# EAGLE design matrix+segmen_shalat_v1.3A (EAGLE 9.5.2)

## Sheet 1 of 2
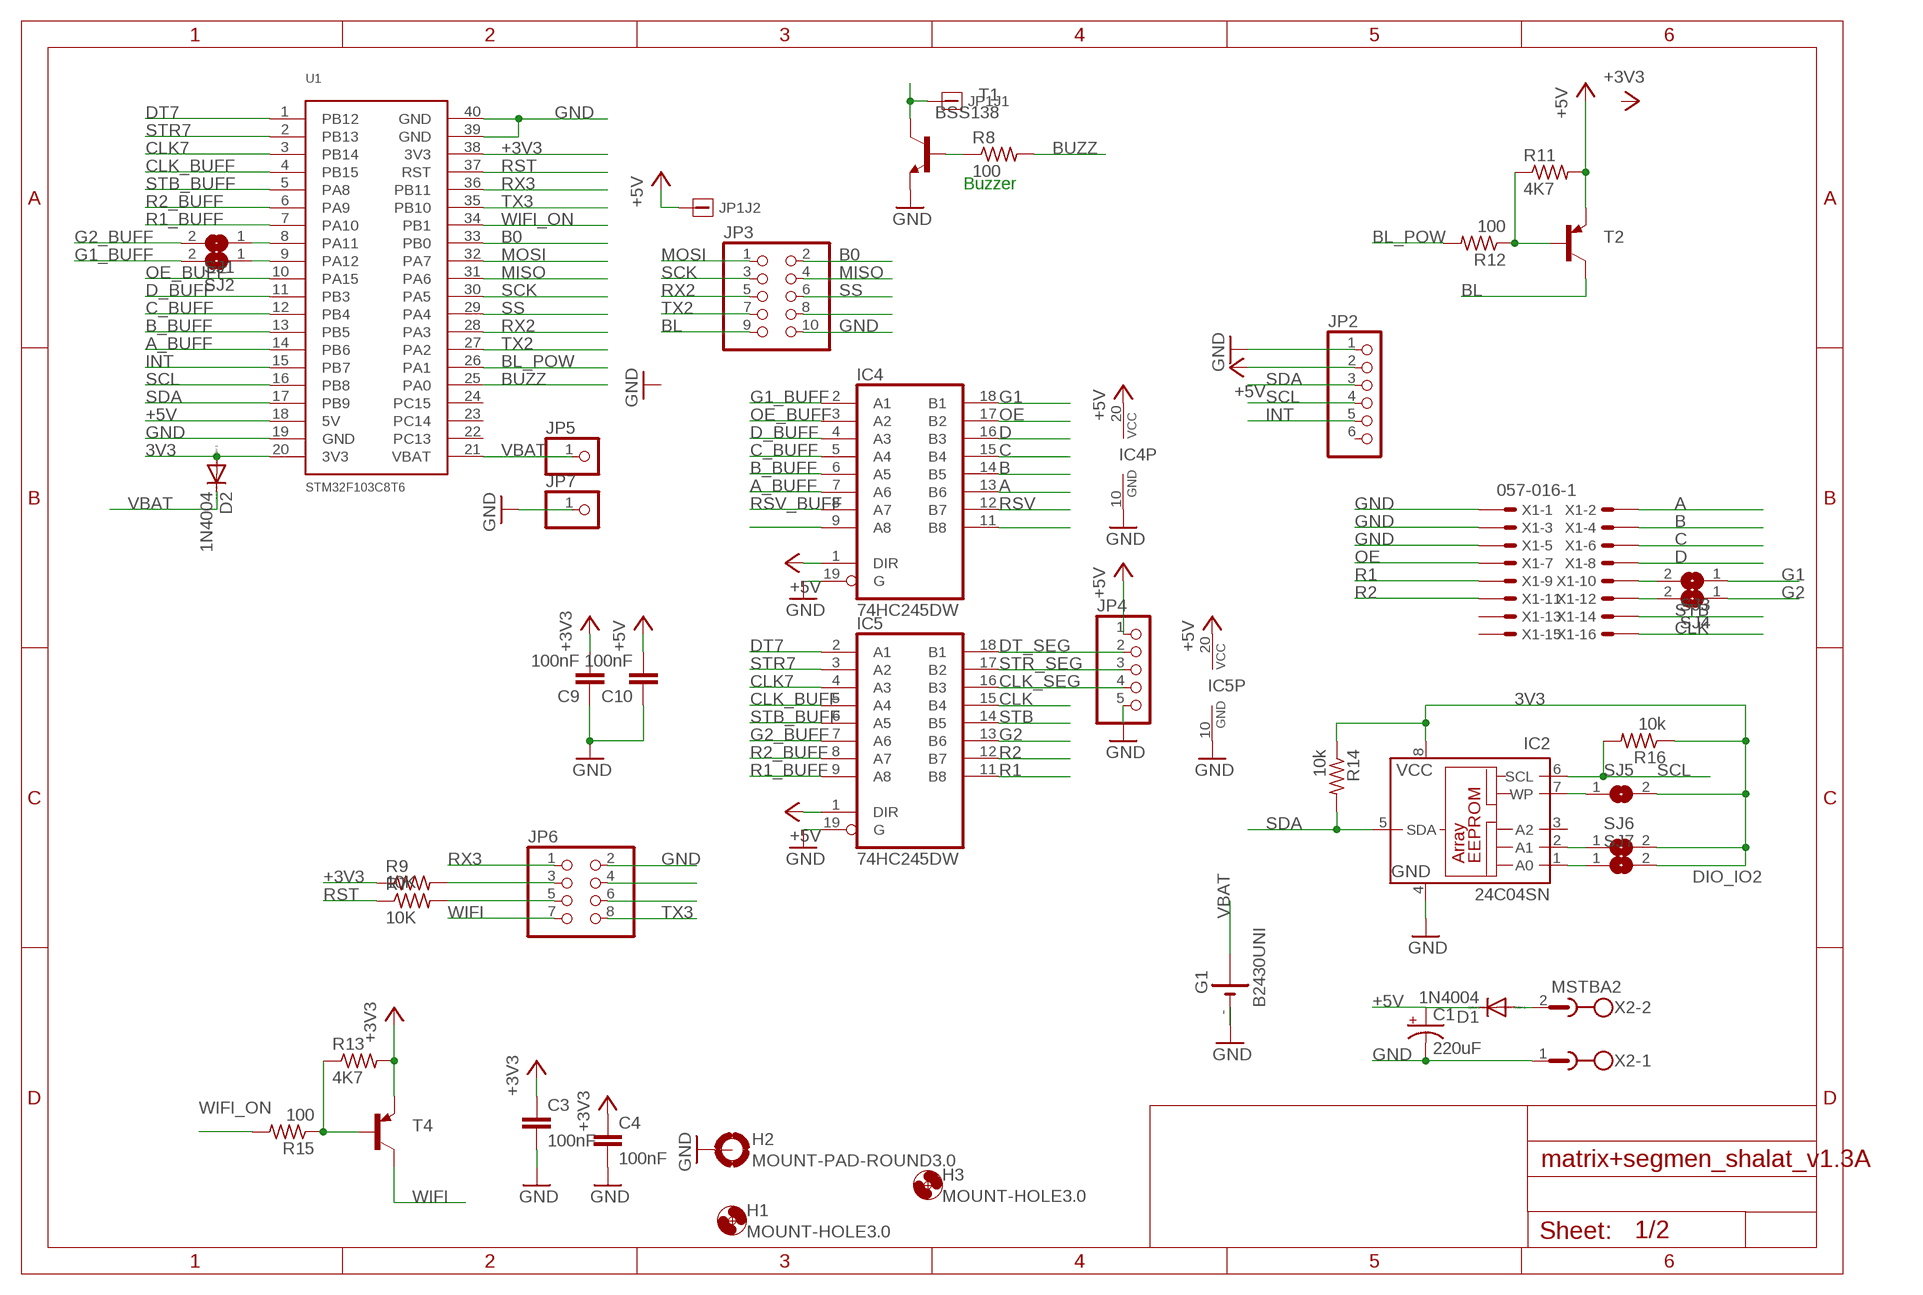
[diagram p0: schematic, sheet 1]

### Parts
C1  220uF  CPOL-USE3.5-8  [E3,5-8]
C3  100nF  C-EUC0805  [C0805]
C4  100nF  C-EUC0805  [C0805]
C9  100nF  C-EUC0805  [C0805]
C10  100nF  C-EUC0805  [C0805]
D1  1N4004  [DO41-10]
D2  1N4004  [DO41-10]
G1  B2430UNI  [B2430UNI]
H1  MOUNT-HOLE3.0  [3,0]
H2  MOUNT-PAD-ROUND3.0  [3,0-PAD]
H3  MOUNT-HOLE3.0  [3,0]
IC2  24C04SN  [SO-08]
IC4  74HC245DW  [SO20W]
IC5  74HC245DW  [SO20W]
JP1  CON2-3.81  [CON2-3.81]
JP2  PINHD-1X6  [1X06]
JP3  PINHD-2X5  [2X05]
JP4  PINHD-1X5  [1X05]
JP5  PINHD-1X1  [1X01]
JP6  PINHD-2X4  [2X04]
JP7  PINHD-1X1  [1X01]
R7  10K  R-US_R0805  [R0805]
R8  100  R-US_R0805  [R0805]
R9  10K  R-US_R0805  [R0805]
R11  4K7  R-US_R0805  [R0805]
R12  100  R-US_R0805  [R0805]
R13  4K7  R-US_R0805  [R0805]
R14  10k  R-US_R0805  [R0805]
R15  100  R-US_R0805  [R0805]
R16  10k  R-US_R0805  [R0805]
SJ1  SJ  [SJ]
SJ2  SJ  [SJ]
SJ3  SJ  [SJ]
SJ4  SJ  [SJ]
SJ5  SJ  [SJ]
SJ6  SJ  [SJ]
SJ7  SJ  [SJ]
T1  BSS138  MMBT2222ALT1-NPN-SOT23-BEC  [SOT23-BEC]
T2  -PNP-TO126V  [TO126V]
T4  -PNP-TO126V  [TO126V]
U1  STM32F103C8T6  [STM32F103]
X1  057-016-1  [057-016-1]
X2  MSTBA2  [MSTBA2]

### Nets
3V3: D2.A IC2.8(VCC) R14.1 R16.1 SJ5.2 SJ6.2 SJ7.2 U1.20(3V3)
+3V3: C3.1 C4.1 C9.2 R9.1 R13.2 T4.1(E) U1.38(3V3)
+5V: C1.+ C10.2 D1.C IC4.1(DIR) IC4.20(VCC) IC5.1(DIR) IC5.20(VCC) JP1.2 JP2.2 JP4.1 R11.2 T2.1(E) U1.18(5V)
A: IC4.13(B6) X1.2
A_BUFF: IC4.7(A6) U1.14(PB6)
B: IC4.14(B5) X1.4
B0: JP3.2 U1.33(PB0)
B_BUFF: IC4.6(A5) U1.13(PB5)
BL: JP3.9 T2.2(C)
BL_POW: R12.2 U1.26(PA1)
BUZZ: R8.2 U1.25(PA0)
C: IC4.15(B4) X1.6
C_BUFF: IC4.5(A4) U1.12(PB4)
CLK: IC5.15(B4) X1.16
CLK7: IC5.4(A3) U1.3(PB14)
CLK_BUFF: IC5.5(A4) U1.4(PB15)
CLK_SEG: IC5.16(B3) JP4.4
D: IC4.16(B3) X1.8
D_BUFF: IC4.4(A3) U1.11(PB3)
DT7: IC5.2(A1) U1.1(PB12)
DT_SEG: IC5.18(B1) JP4.2
G1: IC4.18(B1) SJ3.1
G1_BUFF: IC4.2(A1) SJ2.2
G2: IC5.13(B6) SJ4.1
G2_BUFF: IC5.7(A6) SJ1.2
GND: C1.- C3.2 C4.2 C9.1 C10.1 G1.- G1.-@1(-) H2.B3,0(MOUNT) IC2.4(GND) IC4.10(GND) IC4.19(G) IC5.10(GND) IC5.19(G) JP2.1 JP3.10 JP4.5 JP6.2 JP7.1 T1.E U1.19(GND) U1.39(GND) U1.40(GND) X1.1 X1.3 X1.5 X2.1
INT: JP2.5 U1.15(PB7)
MISO: JP3.4 U1.31(PA6)
MOSI: JP3.1 U1.32(PA7)
N$1: R11.1 R12.1 T2.3(B)
N$2: IC4.9(A8)
N$5: R8.1 T1.B
N$6: JP1.1 T1.C
N$7: JP6.3 R9.2
N$8: IC2.2(A1) SJ6.1
N$9: IC4.11(B8)
N$10: JP6.4
N$11: R13.1 R15.1 T4.3(B)
N$12: SJ1.1 U1.8(PA11)
N$13: SJ2.1 U1.9(PA12)
N$14: SJ4.2 X1.12
N$15: SJ3.2 X1.10
N$16: IC2.1(A0) SJ7.1
N$19: JP6.5 R7.2
N$20: JP6.6
N$26: JP3.8
N$41: D1.A X2.2
N$123: IC2.7(WP) SJ5.1
OE: IC4.17(B2) X1.7
OE_BUFF: IC4.3(A2) U1.10(PA15)
R1: IC5.11(B8) X1.9
R1_BUFF: IC5.9(A8) U1.7(PA10)
R2: IC5.12(B7) X1.11
R2_BUFF: IC5.8(A7) U1.6(PA9)
RST: R7.1 U1.37(RST)
RSV: IC4.12(B7)
RSV_BUFF: IC4.8(A7)
RX2: JP3.5 U1.28(PA3)
RX3: JP6.1 U1.36(PB11)
SCK: JP3.3 U1.30(PA5)
SCL: IC2.6(SCL) JP2.4 R16.2 U1.16(PB8)
SDA: IC2.5(SDA) JP2.3 R14.2 U1.17(PB9)
SS: JP3.6 U1.29(PA4)
STB: IC5.14(B5) X1.14
STB_BUFF: IC5.6(A5) U1.5(PA8)
STR7: IC5.3(A2) U1.2(PB13)
STR_SEG: IC5.17(B2) JP4.3
TX2: JP3.7 U1.27(PA2)
TX3: JP6.8 U1.35(PB10)
VBAT: D2.C G1.+@4(+) JP5.1 U1.21(VBAT)
WIFI: JP6.7 T4.2(C)
WIFI_ON: R15.2 U1.34(PB1)
Unconnected: IC2.3(A2) JP2.6 U1.22(PC13) U1.23(PC14) U1.24(PC15) X1.13 X1.15

### Notes on the sheet
- Buzzer

## Sheet 2 of 2
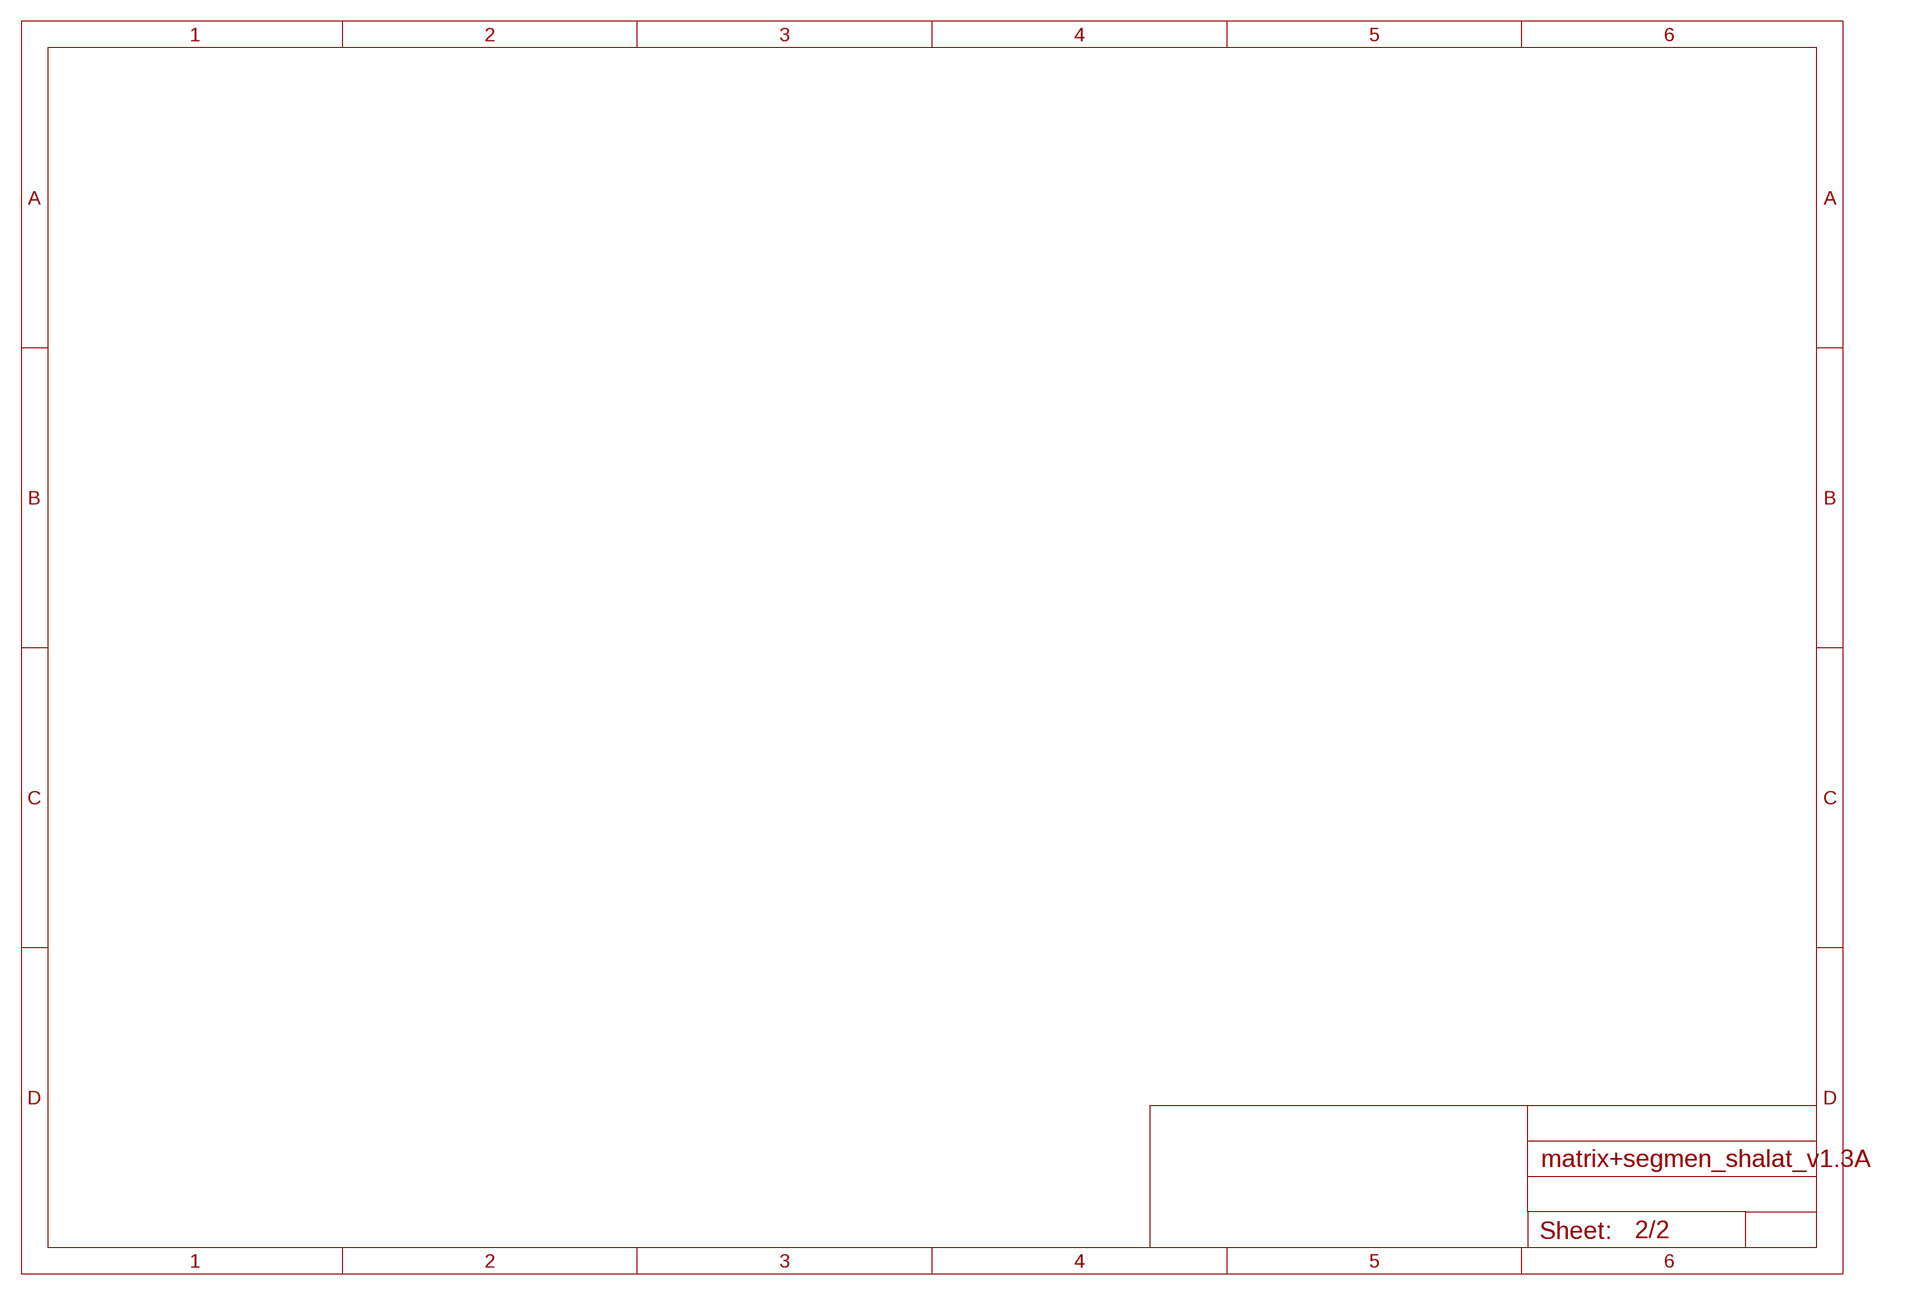
[diagram p1: schematic, sheet 2]

## Library data of the parts
C1 = rcl:CPOL-US: POLARIZED CAPACITOR, American symbol
C3 C4 = rcl:C-EU: CAPACITOR, European symbol
C9 C10 = resistor:C-EU: CAPACITOR, European symbol
D1 D2 = diode:1N4004: DIODE general purpose rectifier, 1 A
G1 = battery:B2430UNI: LI BATTERY
H1 H3 = holes:MOUNT-HOLE: MOUNTING HOLE with drill center marker
H2 = holes:MOUNT-PAD-ROUND: MOUNTING PAD, round
IC2 = microchip:24C*: Serial EEPROM 1 K/2 K/4 K; MPN: M24C04-WMN6P; OC_FARNELL: 9882812; OC_NEWARK: 83K1376
IC4 IC5 = 74xx-eu:74*245: Octal BUS TRANSCEIVER, 3-state
JP1 = IyunLib:CON2-3.81
JP2 = pinhead:PINHD-1X6: PIN HEADER
JP3 = pinhead:PINHD-2X5: PIN HEADER
JP4 = pinhead:PINHD-1X5: PIN HEADER
JP5 JP7 = pinhead:PINHD-1X1: PIN HEADER
JP6 = pinhead:PINHD-2X4: PIN HEADER
R7-R9 R11-R16 = rcl:R-US_: RESISTOR, American symbol
SJ1-SJ7 = jumper:SJ: SMD solder JUMPER
T1 = transistor:*-NPN-: NPN Transistror BF959 corrected 2008.03.06
T2 T4 = transistor:*-PNP-: PNP Transistror
U1 = IyunLib:STM32F103C8T6
X1 = con-panduit:057-016-: CONNECTOR 10-pin series 057 contact pc board low profile headers; OC_FARNELL: unknown; OC_NEWARK: unknown
X2 = con-phoenix-508:MSTBA2: PHOENIX; MF: FARNELL; MPN: 1757242; OC_FARNELL: 3705171; OC_NEWARK: 71C4161

## Board
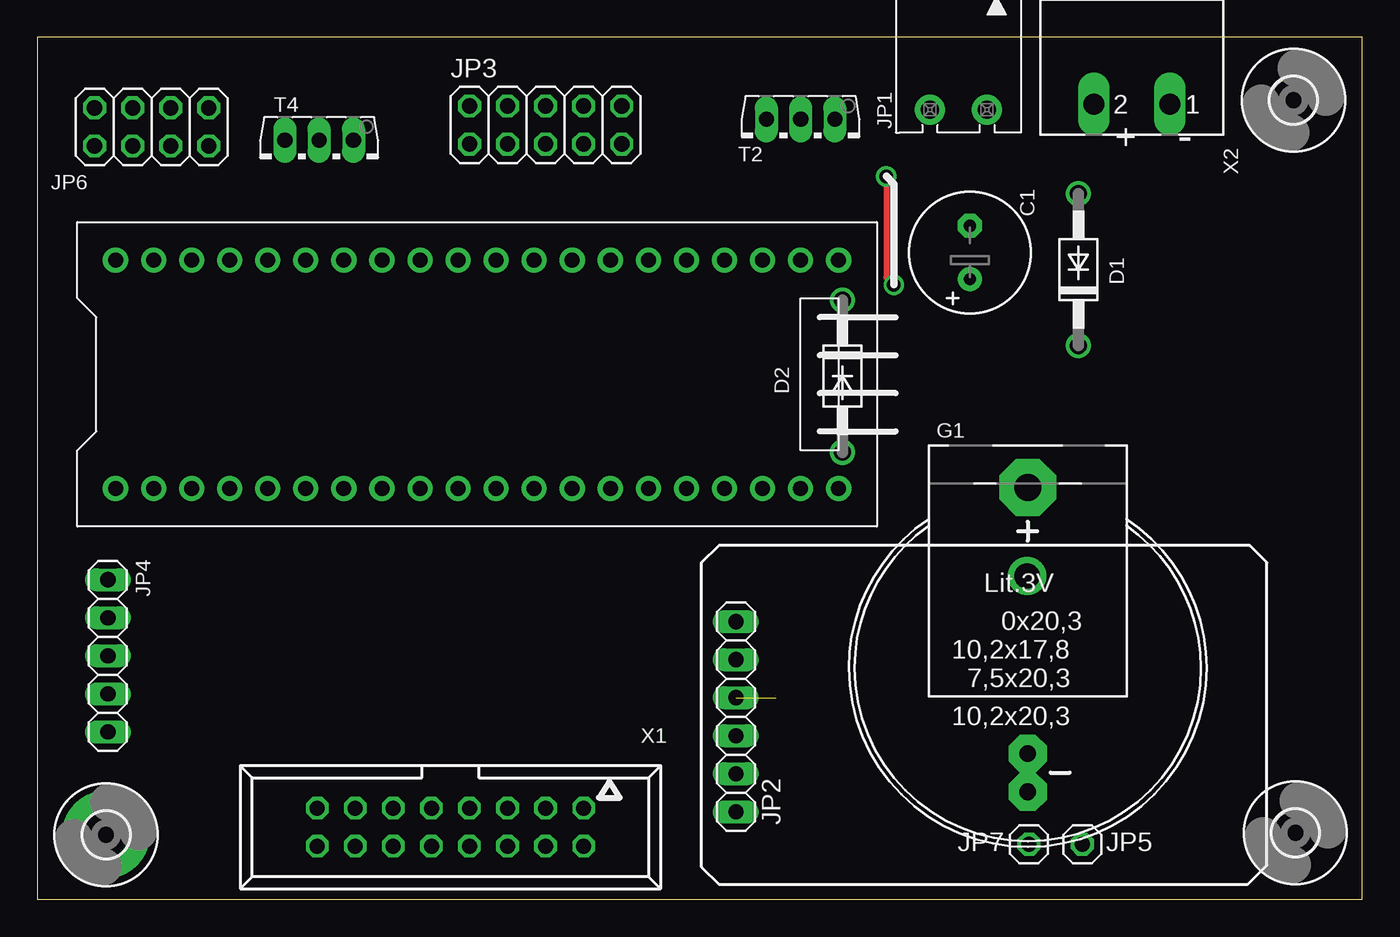
[diagram p2: board, top side]
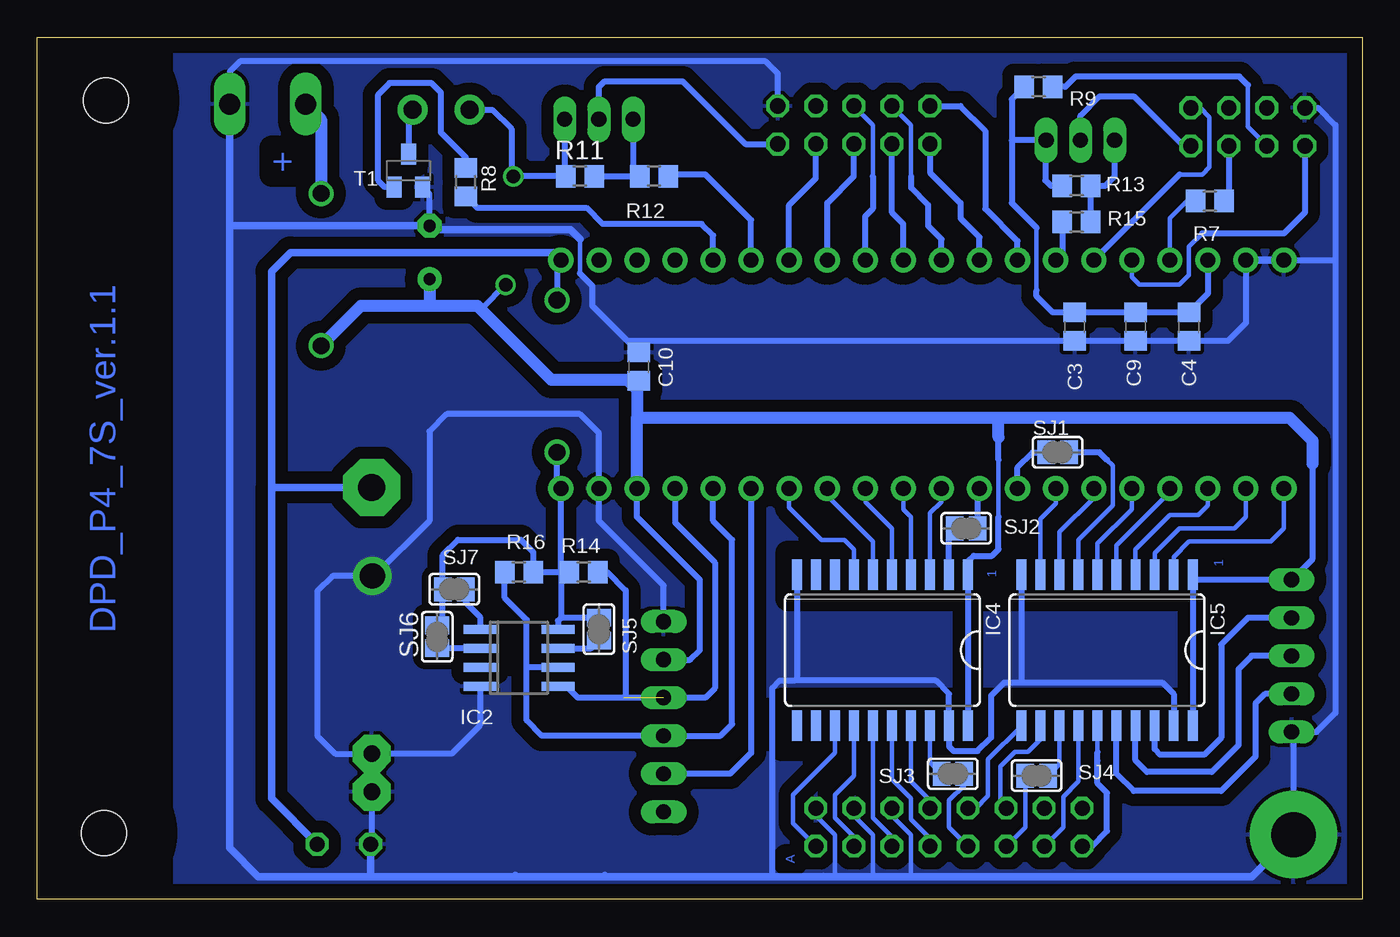
[diagram p3: board, bottom side, seen from below]

Size 88.39 x 57.53 mm. Coordinates in mm from the lower left corner, seen from the top.
Outline: 0,0 88.39,0 88.39,57.53 0,57.53 0,0
Copper layers (1*16): Top 0.035mm / dielectric 1.5mm / Bottom 0.035mm
Design rules "default": minimum track width 10mil, minimum drill 24mil, track to track 8mil, track to pad 8mil, pad to pad 8mil, via to via 8mil, smd to smd 8mil, copper to edge 40mil, drill to drill 8mil, minimum pad ring 10mil, minimum via ring 8mil, stop-mask expansion 4mil, vias tented up to drill 0mil, thermal gap 10mil
bRestrict: area 10.5,20.1 to 38.4,23.1; area 10.5,10 to 38.7,13.3

### Footprints (pad centres in the part's own frame; a part is rotated, then mirrored left to right if it is on the bottom)
E3,5-8 = drill 0.813 pad 1.6: + -1.778,0 | drill 0.813 pad 1.6 octagon: - 1.778,0
C0805 = smd 1.3 x 1.5: 1 -0.95,0; 2 0.95,0
DO41-10 = drill 1.118: A 5.08,0; C -5.08,0
B2430UNI = drill 1.803 pad 3.81 octagon: +@4 0,12.065 | drill 1.118 pad 2.54 octagon: - 0,-5.715; -@1 0,-8.255
3,0 = hole 3: 0,0
3,0-PAD = drill 3 pad 5.842: B3,0 0,0
SO-08 = smd 0.6 x 2.2: 1 -1.905,-2.6; 2 -0.635,-2.6; 3 0.635,-2.6; 4 1.905,-2.6; 5 1.905,2.6; 6 0.635,2.6; 7 -0.635,2.6; 8 -1.905,2.6
SO20W = smd 0.66 x 2.032: 1 -5.715,-5.029; 2 -4.445,-5.029; 3 -3.175,-5.029; 4 -1.905,-5.029; 5 -0.635,-5.029; 6 0.635,-5.029; 7 1.905,-5.029; 8 3.175,-5.029; 9 4.445,-5.029; 10 5.715,-5.029; 11 5.715,5.029; 12 4.445,5.029; 13 3.175,5.029; 14 1.905,5.029; 15 0.635,5.029; 16 -0.635,5.029; 17 -1.905,5.029; 18 -3.175,5.029; 19 -4.445,5.029; 20 -5.715,5.029
CON2-3.81 = drill 1.2 pad 2: 1 -2.54,0; 2 1.27,0
1X06 = drill 1.016 long: 1 -6.35,0; 2 -3.81,0; 3 -1.27,0; 4 1.27,0; 5 3.81,0; 6 6.35,0
2X05 = drill 1.016 octagon: 1 -5.08,-1.27; 2 -5.08,1.27; 3 -2.54,-1.27; 4 -2.54,1.27; 5 0,-1.27; 6 0,1.27; 7 2.54,-1.27; 8 2.54,1.27; 9 5.08,-1.27; 10 5.08,1.27
1X05 = drill 1.016 long: 1 -5.08,0; 2 -2.54,0; 3 0,0; 4 2.54,0; 5 5.08,0
1X01 = drill 1.016 octagon: 1 0,0
2X04 = drill 1.016 octagon: 1 -3.81,-1.27; 2 -3.81,1.27; 3 -1.27,-1.27; 4 -1.27,1.27; 5 1.27,-1.27; 6 1.27,1.27; 7 3.81,-1.27; 8 3.81,1.27
R0805 = smd 1.3 x 1.5: 1 -0.95,0; 2 0.95,0
SJ = smd 1.168 x 1.6: 1 -0.762,0; 2 0.762,0
SOT23-BEC = smd 1 x 1.4: B -0.95,-1.1; C 0,1.1; E 0.95,-1.1
TO126V = drill 1.016 long: 1 -2.286,-1.27; 2 0,-1.27; 3 2.286,-1.27
STM32F103 = drill 1 pad 1.676: 1 -7.62,24.13; 2 -7.62,21.59; 3 -7.62,19.05; 4 -7.62,16.51; 5 -7.62,13.97; 6 -7.62,11.43; 7 -7.62,8.89; 8 -7.62,6.35; 9 -7.62,3.81; 10 -7.62,1.27; 11 -7.62,-1.27; 12 -7.62,-3.81; 13 -7.62,-6.35; 14 -7.62,-8.89; 15 -7.62,-11.43; 16 -7.62,-13.97; 17 -7.62,-16.51; 18 -7.62,-19.05; 19 -7.62,-21.59; 20 -7.62,-24.13; 21 7.62,-24.13; 22 7.62,-21.59; 23 7.62,-19.05; 24 7.62,-16.51; 25 7.62,-13.97; 26 7.62,-11.43; 27 7.62,-8.89; 28 7.62,-6.35; 29 7.62,-3.81; 30 7.62,-1.27; 31 7.62,1.27; 32 7.62,3.81; 33 7.62,6.35; 34 7.62,8.89; 35 7.62,11.43; 36 7.62,13.97; 37 7.62,16.51; 38 7.62,19.05; 39 7.62,21.59; 40 7.62,24.13
057-016-1 = drill 1 octagon: 1 -8.89,-1.27; 2 -8.89,1.27; 3 -6.35,-1.27; 4 -6.35,1.27; 5 -3.81,-1.27; 6 -3.81,1.27; 7 -1.27,-1.27; 8 -1.27,1.27; 9 1.27,-1.27; 10 1.27,1.27; 11 3.81,-1.27; 12 3.81,1.27; 13 6.35,-1.27; 14 6.35,1.27; 15 8.89,-1.27; 16 8.89,1.27
MSTBA2 = drill 1.397 long: 1 -2.54,5.08; 2 2.54,5.08

### Placement (x,y rotation side)
C1  62.23,43.18 90 top
C3  19.18,38.23 270 bottom
C4  11.56,38.23 270 bottom
C9  15.11,38.23 90 bottom
C10  48.26,35.56 270 bottom
D1  69.47,42.04 90 top
D2  53.72,34.92 270 top
G1  66.08,15.44 0 top
H1  83.95,4.45 0 top
H2  4.57,4.32 0 top
H3  83.82,53.34 0 top
IC2  56.26,16.13 270 bottom
IC4  32,16.64 180 bottom
IC5  17.02,16.64 180 bottom
JP1  60.83,52.7 180 top
JP2  46.61,12.19 270 top
JP3  33.91,51.69 0 top
JP4  4.7,16.26 270 top
JP5  69.72,3.68 0 top
JP6  7.62,51.56 0 top
JP7  66.17,3.68 0 top
R7  10.16,46.61 0 bottom
R8  59.82,47.88 270 bottom
R9  21.59,54.23 0 bottom
R11  52.2,48.26 180 bottom
R12  47.24,48.26 0 bottom
R13  19.05,47.62 180 bottom
R14  51.94,21.84 0 bottom
R15  19.05,45.21 180 bottom
R16  56.26,21.84 180 bottom
SJ1  20.32,29.84 0 bottom
SJ2  26.42,24.77 180 bottom
SJ3  27.3,8.38 0 bottom
SJ4  21.72,8.25 180 bottom
SJ5  50.93,18.03 90 bottom
SJ6  61.72,17.53 90 bottom
SJ7  60.58,20.7 180 bottom
T1  63.63,48.64 0 bottom
T2  50.93,50.8 180 top
T4  18.8,49.4 180 top
U1  29.34,35.05 90 top
X1  27.56,4.83 180 top
X2  73.02,58.17 180 top

### Tracks (layer width: path | path; a pad name or v marks a point on that pad's centre or on a via)
3V3
  Bottom 0.406: D2.A 53.72,27.69 U1.20 53.47,21.72 | 53.47,21.72 53.34,21.84 R14.1 R16.1 55.31,23.18 56.13,24 60.32,24 61.34,22.99 SJ7.2 61.34,18.67 SJ6.2 | IC2.8 53.66,18.6 53.47,18.8 | SJ5.2 53.47,18.8 | 53.47,21.72 53.47,18.8
+3V3
  Bottom 0.305: 21.72,40.64 21.72,44.83
  Bottom 0.406: 10.29,42.8 U1.38 10.29,40.45 C4.1 C9.2 C3.1 20.64,39.18 21.72,40.26 21.72,40.64 | 23.37,50.67 23.37,46.48 21.72,44.83 | R13.2 20.76,47.62 21.14,48.01 21.14,50.61 T4.1 23.37,50.67 | R9.1 23.37,53.4 23.37,50.67
+5V  (via drill 0.9)
  Top 0.406: v56.64,48.26 56.64,41.53 v57.15,41.02
  Bottom 0.305: 24.26,25.53 24.26,29.34
  Bottom 0.406: 48.39,27.81 U1.18 | IC4.20 IC4.1 26.29,22.55 25.91,22.94 24.69,22.94 24.26,23.37 24.26,25.53 | IC5.1 11.3,21.34 | 11.3,21.34 IC5.20 | 59.05,39.62 58.86,39.43 | 11.3,21.34 JP4.1 3.3,22.73 3.3,29.08 3.3,30.86 | 66.04,39.75 65.91,39.62 | U1.18 48.39,29.34 | v57.15,41.02 58.74,39.43 58.74,39.31 | JP2.2 44.83,16 44.2,16.64 44.2,21.34 48.39,25.53 U1.18 | 24.26,29.34 24.26,30.86 | JP1.2 58.04,52.7 56.77,51.44 56.77,48.39 v56.64,48.26 R11.2 53.21,48.33 T2.1
  Bottom 0.813: 62.23,39.62 59.05,39.62 58.74,39.31 54.1,34.67 49.02,34.67 48.39,34.04 | D1.C 66.8,39.62 65.91,39.62 62.23,39.62 | C1.+ 62.23,39.62 | 3.3,29.08 3.3,30.61 4.83,32.13 24.26,32.13 | 24.26,32.13 48.39,32.13 | 24.26,30.86 24.26,32.13 | U1.18 48.39,32.13 | 48.39,34.04 48.39,34.48 C10.2 | 48.39,34.04 48.39,32.13
A
  Bottom 0.305: IC4.13 35.18,9.78 37.97,6.98 37.97,5.08 X1.2
A_BUFF
  Bottom 0.305: U1.14 38.23,26.16 36.07,24 34.54,24 33.91,23.37 IC4.7
B
  Bottom 0.305: IC4.14 33.91,8.25 35.18,6.98 35.18,5.46 33.91,4.19 X1.4
B0
  Bottom 0.406: U1.33 22.99,43.94 25.15,46.1 25.15,51.31 26.8,52.96 JP3.2
B_BUFF
  Bottom 0.305: U1.13 35.69,26.92 32.64,23.88 IC4.6
BL
  Bottom 0.406: T2.2 50.93,54.23 50.55,54.61 45.34,54.61 41.15,50.42 JP3.9
BL_POW
  Bottom 0.406: R12.2 46.17,48.39 43.81,48.39 40.77,45.34 U1.26
BUZZ
  Bottom 0.406: U1.25 43.31,44.32 44.07,45.09 50.67,45.09 51.75,46.17 59.05,46.17 R8.2
C
  Bottom 0.305: IC4.15 32.64,5.46 31.37,4.19 X1.6
C_BUFF
  Bottom 0.305: U1.12 33.15,26.54 31.37,24.77 IC4.5
CLK
  Bottom 0.305: 17.65,11.56 IC5.15 17.65,9.27 | 17.65,9.83 17.65,9.88
  Bottom 0.406: X1.16 18.03,3.56 17.02,4.57 17.02,7.11 17.65,7.75 17.65,9.27 17.65,9.83
CLK7
  Bottom 0.305: IC5.4 15.11,23.37 12.83,25.65 10.92,25.65 10.29,26.29 U1.3
CLK_BUFF
  Bottom 0.305: U1.4 12.83,27.18 16.38,23.62 IC5.5
CLK_SEG
  Bottom 0.406: JP4.4 6.48,13.72 7.11,13.08 7.11,9.53 9.4,7.24 15.24,7.24 16.38,8.38 IC5.16
D
  Bottom 0.305: IC4.16 31.37,8 30.1,6.73 30.1,5.33 28.83,4.06 X1.8
D_BUFF
  Bottom 0.305: U1.11 30.61,26.04 30.1,25.53 IC4.4
DT7
  Bottom 0.305: IC5.2 12.57,22.86 11.56,23.88 6.1,23.88 5.21,24.77 U1.1
DT_SEG
  Bottom 0.406: JP4.2 7.62,18.8 9.4,17.02 9.4,10.79 10.54,9.65 13.46,9.65 13.84,10.03 IC5.18
G1
  Bottom 0.305: SJ3.1 28.83,9.14 IC4.18
G1_BUFF
  Bottom 0.406: IC4.2 27.56,24.38 SJ2.2
G2
  Bottom 0.305: IC5.13 20.19,9.02 SJ4.1
G2_BUFF
  Bottom 0.305: IC5.7 18.92,24 16.64,26.29 16.64,28.96 17.02,29.34
  Bottom 0.406: 17.02,29.34 17.53,29.84 SJ1.2
GND  (via drill 1.7)
  Bottom 0.305: 35.94,1.65 35.81,1.52 | X1.5 31.37,5.59 30.1,4.32 30.1,1.52 | X1.3 33.91,5.59 32.64,4.32 32.64,1.52 | X1.1 36.45,5.59 35.18,4.32 35.18,1.65 35.31,1.52 | 52.2,41.78 52.2,44.07
  Bottom 0.406: U1.19 51.37,27.87 | 52.2,41.78 51.37,40.95 51.37,39.62 49.02,37.28 | IC5.19 12.57,13.72 13.34,14.48 22.61,14.48 | 22.61,14.48 23.88,14.48 24.77,13.59 24.77,10.79 25.65,9.91 27.25,9.91 27.56,10.21 IC4.19 27.56,13.72 28.45,14.6 37.85,14.6 | 22.73,21.97 IC5.10 22.73,14.6 22.61,14.48 | H2.B3,0 4.57,11.05 JP4.5 3.05,11.18 1.78,12.45 1.78,42.67 | 37.85,14.6 38.86,14.6 39.37,14.1 39.37,1.52 | IC4.10 37.72,14.73 37.85,14.6 | 56.51,1.65 56.39,1.52 | G1.- G1.-@1 66.08,3.77 JP7.1 66.29,3.68 | C1.- 62.23,47.09 T1.E | 50.55,1.65 50.42,1.52 | JP2.1 46.61,20.95 50.93,25.27 U1.19 | G1.- 68.53,9.73 69.72,10.92 69.72,20.57 68.71,21.59 v66.04,21.59 65.91,21.59 62.23,25.27 62.23,31.24 61.09,32.38 52.2,32.38 50.93,31.11 U1.19 | C10.1 49.02,37.28 | IC2.4 58.86,11.62 60.76,9.73 G1.- | 1.78,42.67 1.78,51.69 2.92,52.83 JP6.2 | U1.40 1.78,42.67 | JP3.10 38.99,55.12 39.8,55.93 74.88,55.93 75.56,55.24 75.56,54.1 | U1.39 7.75,38.48 8.95,37.28 C4.2 C9.1 C3.2 49.02,37.28
  Bottom 0.508: 52.2,44.07 52.83,44.7 61.98,44.7 C1.- 75.56,44.96 | 66.17,1.52 73.66,1.52 75.56,3.43 75.56,44.96 | 66.17,1.52 56.39,1.52 50.42,1.52 42.21,1.52 | 42.08,1.52 39.37,1.52 35.81,1.52 35.31,1.52 32.64,1.52 30.1,1.52 7.37,1.52 H2.B3,0 | U1.40 U1.39 7.94,42.48 | 75.56,54.1 X2.1 75.56,44.96 | JP7.1 66.17,1.52
  pour Bottom (isolate 0.813): 0.38,56.52 79.25,56.52 79.25,0.13 0.38,0.13
INT
  Bottom 0.406: JP2.5 42.16,8.38 40.77,9.78 U1.15
MISO
  Bottom 0.305: JP3.4 30.1,51.69 30.1,48.26
  Bottom 0.406: U1.31 28.07,44.07 28.96,44.96 28.96,46.35 30.1,47.5 30.1,48.26
MOSI
  Bottom 0.406: U1.32 25.53,44.2 26.8,45.47 26.8,46.48 28.83,48.51 JP3.1
N$1
  Bottom 0.406: R11.1 48.64,48.26 | 48.64,48.26 R12.1 | T2.3 48.64,48.26
N$5
  Bottom 0.406: T1.B 65.21,47.54 65.66,47.99 65.66,53.72 64.9,54.48 62.1,54.48 61.47,53.85 61.47,51.18 59.82,49.53 R8.1
N$6
  Bottom 0.406: JP1.1 63.63,52.45 T1.C
N$7
  Bottom 0.305: JP6.3 7.62,51.56 7.62,54.36
  Bottom 0.406: 7.62,54.36 8.18,54.91 19.13,54.91 19.81,54.23 R9.2
N$8
  Bottom 0.406: IC2.2 SJ6.1
N$11
  Bottom 0.406: T4.3 16.51,48.26 17.14,47.62 R13.1 R15.1
N$12
  Bottom 0.406: U1.8 22.99,28.83 21.97,29.84 SJ1.1
N$13
  Bottom 0.406: U1.9 25.65,27.3 SJ2.1
N$14
  Bottom 0.305: X1.12 22.48,4.83 SJ4.2
N$15
  Bottom 0.305: X1.10 27.56,4.83 27.56,6.6 26.54,7.62 SJ3.2
N$16
  Bottom 0.406: SJ7.1 59.82,19.81 58.86,18.86 IC2.1
N$19
  Bottom 0.406: R7.2 8.89,46.93 JP6.5
N$41
  Bottom 0.813: X2.2 69.47,52.07 D1.A
N$123
  Bottom 0.406: IC2.7 51.43,16.76 SJ5.1
OE
  Bottom 0.305: 28.83,6.48 X1.7 28.83,6.6 30.1,7.87 IC4.17
OE_BUFF
  Bottom 0.305: U1.10 28.07,26.54 28.83,25.78 IC4.3
R1
  Bottom 0.305: IC5.11 22.73,11.56 24.96,9.33 24.96,6.92 25.78,6.1 X1.9
R1_BUFF
  Bottom 0.305: U1.7 20.45,26.42 21.46,25.4 IC5.9
R2
  Bottom 0.305: X1.11 24.13,6.48 24.13,8.89 23.18,9.84 22.29,9.84 21.46,10.67 IC5.12
R2_BUFF
  Bottom 0.305: U1.6 17.91,26.8 20.19,24.51 IC5.8
RST
  Bottom 0.305: U1.37 12.83,45.47 11.63,46.66 11.18,46.68 R7.1
RX2
  Bottom 0.406: U1.28 35.69,46.48 33.91,48.26 JP3.5
RX3
  Bottom 0.305: U1.36 15.37,41.53 14.86,41.02 12.19,41.02 11.56,41.66 11.56,43.56 10.67,44.45
  Bottom 0.406: JP6.1 3.81,45.85 5.21,44.45 10.67,44.45
SCK
  Bottom 0.406: U1.30 30.61,45.09 31.37,45.85 JP3.3
SCL
  Bottom 0.305: 52.45,10.92 46.35,10.92
  Bottom 0.406: U1.16 43.31,25.27 42.04,24 42.04,11.68 42.8,10.92 46.35,10.92 JP2.4 52.45,10.92 54.74,10.92 55.75,11.94 55.75,15.49 | 55.75,15.49 55.75,18.67 57.21,20.13 R16.2 | IC2.6 55.75,15.49
SDA  (1 unrouted)
  Bottom 0.406: U1.17 45.85,25.15 43.18,22.48 43.18,14.1 43.81,13.46 JP2.3 49.15,13.46 49.15,20.63 50.36,21.84 R14.2 | 49.28,13.46 52.32,13.46 53.09,14.22 IC2.5
SS
  Bottom 0.305: JP3.6 32.64,51.69 32.64,48.26
  Bottom 0.406: U1.29 33.15,45.59 32.64,46.1 32.64,48.26
STB
  Bottom 0.305: IC5.14 18.92,7.87 19.94,6.86 19.94,4.83 X1.14
STB_BUFF
  Bottom 0.305: U1.5 15.37,26.04 17.65,23.75 IC5.6
STR7
  Bottom 0.305: IC5.3 13.84,23.11 12.19,24.77 8.51,24.77 7.75,25.53 U1.2
STR_SEG
  Bottom 0.406: JP4.3 7.37,16.26 8.25,15.37 8.25,10.29 10.03,8.51 14.35,8.51 15.11,9.27 IC5.17
TX2
  Bottom 0.406: U1.27 38.23,46.35 36.45,48.13 JP3.7
TX3
  Bottom 0.305: JP6.8 10.79,52.83 10.19,52.22 10.19,48.87 10.67,48.39 12.19,48.39
  Bottom 0.406: U1.35 12.19,48.39
VBAT
  Bottom 0.406: U1.21 53.72,42.42 D2.C
  Bottom 0.508: U1.21 53.97,43.18 71.5,43.18 72.77,41.91 72.77,27.43 | 72.77,27.43 72.77,6.73 JP5.1 | G1.+@4 72.7,27.51 72.77,27.43
WIFI
  Bottom 0.406: T4.2 18.8,52.32 17.53,53.59 15.24,53.59 11.94,50.29 JP6.7
WIFI_ON
  Bottom 0.406: U1.34 20,43.12 R15.2

### Text on the board
Bottom: + | 1 | 1 | DPD_P4_7S_ver.1.1 | A
tNames: + | -